# Altium schematic sheet Sheet1.SchDoc (part 2 of 3)
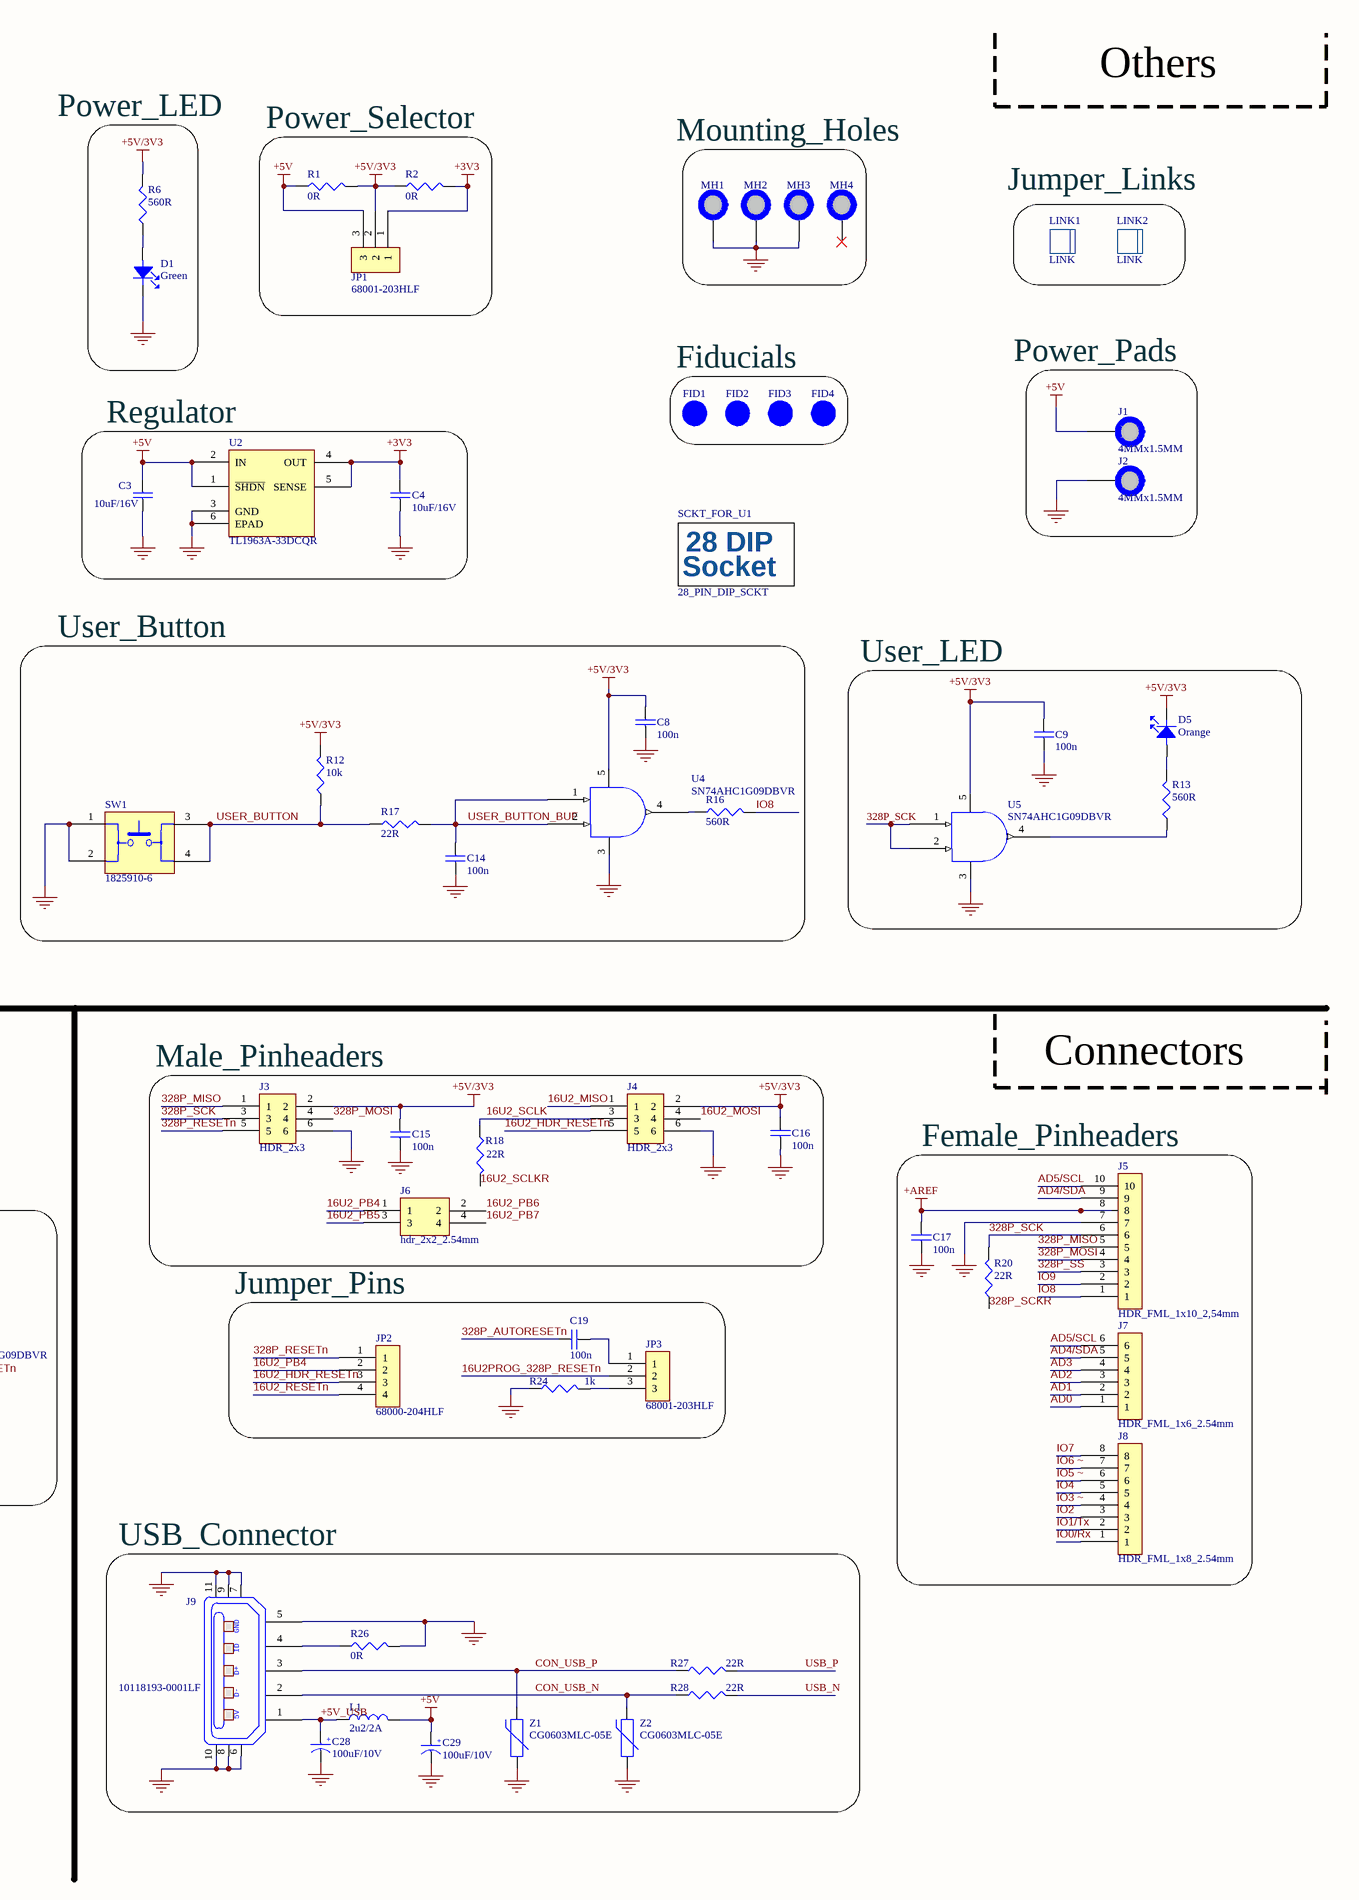
[diagram p2: Sheet1.SchDoc, right]
## Library data of the parts
C1 C8 C9 C18 C19 = capacitor_100n: Multilayer Ceramic Capacitor, 0.1 uF, 50 V, ± 10%, X7R, 0805 [2012 Metric]; Manufacturer: TDK; Manufacturer Part Number: C2012X7R1H104K085AA; Material: 4241ConductorMaterial; Capacitance: 100nF; Voltage Rating: 50V; Supplier 1: Arrow Electronics; RoHS: Yes; Category: Ceramic Capacitors; Stock 1: 84000; Pricing 1: 4000=0.0215, 8000=0.018, 12000=0.017, 28000=0.016, 100000=0.0129, 200000=0.0128, 400000=0.0125 (USD); Mount: Surface Mount; Case/Package: 0805; Number of Pins: 2; Case Code (Metric): 2012; Case Code (Imperial): 0805; Dielectric Material: Ceramic; Min Operating Temperature: -55°C; Max Operating Temperature: 125°C; Tolerance: 10%; Packaging: Tape and Reel; Dielectric: X7R; Package Quantity: 1; Termination: SMD/SMT; Voltage: 50V; Series: C; Length: 2mm; Width: 0.049inch; Height: 0.85mm; Depth: 1.25mm; Thickness: 0.037inch; RoHS Compliant: Yes; Reach SVHC Compliant: No; Lead Free: Lead Free; ComponentLink1URL: https://datasheet.ciiva.com/11788/0900766b80c1bb00-11788128.pdf?src-supplier=Rs; ComponentLink1Description: https://datasheet.ciiva.com/11788/0900766b80c1bb00-11788128.pdf?src-supplier=Rs; ComponentLink2URL: https://datasheet.ciiva.com/23803/1796654-23803035.pdf?src-supplier=Newark; ComponentLink2Description: https://datasheet.ciiva.com/23803/1796654-23803035.pdf?src-supplier=Newark; ComponentLink3URL: https://datasheet.ciiva.com/28602/1571323-28602204.pdf?src-supplier=Element14; ComponentLink3Description: https://datasheet.ciiva.com/28602/1571323-28602204.pdf?src-supplier=Element14; ComponentLink4URL: https://datasheet.ciiva.com/6250/tdkmlcccaprange-6250821.pdf?src-supplier=Digi-Key; ComponentLink4Description: https://datasheet.ciiva.com/6250/tdkmlcccaprange-6250821.pdf?src-supplier=Digi-Key; ComponentLink5URL: https://datasheet.ciiva.com/6250/tdkmlcccaprange-6250824.pdf?src-supplier=Digi-Key; ComponentLink5Description: https://datasheet.ciiva.com/6250/tdkmlcccaprange-6250824.pdf?src-supplier=Digi-Key; ComponentLink6URL: https://datasheet.ciiva.com/24191/e412-c-24191447.pdf?src-supplier=Future+Electronics; ComponentLink6Description: https://datasheet.ciiva.com/24191/e412-c-24191447.pdf?src-supplier=Future+Electronics; Supplier Part Number 1: C2012X7R1H104K085AA
C2 C6 C7 C12 C14-C17 C20 C21 C23 C27 C30 C31 C33 = C2012X7R1H104K085AA: Multilayer Ceramic Capacitor, 0.1 uF, 50 V, ± 10%, X7R, 0805 [2012 Metric]; Manufacturer: TDK; Material: 4241ConductorMaterial; Capacitance: 100nF; Voltage Rating: 50V; Supplier 1: Arrow Electronics; Manufacturer Part Number: C2012X7R1H104K085AA; RoHS: Yes; Category: Ceramic Capacitors; Stock 1: 84000; Pricing 1: 4000=0.0215, 8000=0.018, 12000=0.017, 28000=0.016, 100000=0.0129, 200000=0.0128, 400000=0.0125 (USD); Mount: Surface Mount; Case/Package: 0805; Number of Pins: 2; Case Code (Metric): 2012; Case Code (Imperial): 0805; Dielectric Material: Ceramic; Min Operating Temperature: -55°C; Max Operating Temperature: 125°C; Tolerance: 10%; Packaging: Tape and Reel; Dielectric: X7R; Package Quantity: 1; Termination: SMD/SMT; Voltage: 50V; Series: C; Length: 2mm; Width: 0.049inch; Height: 0.85mm; Depth: 1.25mm; Thickness: 0.037inch; RoHS Compliant: Yes; Reach SVHC Compliant: No; Lead Free: Lead Free; ComponentLink1URL: https://datasheet.ciiva.com/11788/0900766b80c1bb00-11788128.pdf?src-supplier=Rs; ComponentLink1Description: https://datasheet.ciiva.com/11788/0900766b80c1bb00-11788128.pdf?src-supplier=Rs; ComponentLink2URL: https://datasheet.ciiva.com/23803/1796654-23803035.pdf?src-supplier=Newark; ComponentLink2Description: https://datasheet.ciiva.com/23803/1796654-23803035.pdf?src-supplier=Newark; ComponentLink3URL: https://datasheet.ciiva.com/28602/1571323-28602204.pdf?src-supplier=Element14; ComponentLink3Description: https://datasheet.ciiva.com/28602/1571323-28602204.pdf?src-supplier=Element14; ComponentLink4URL: https://datasheet.ciiva.com/6250/tdkmlcccaprange-6250821.pdf?src-supplier=Digi-Key; ComponentLink4Description: https://datasheet.ciiva.com/6250/tdkmlcccaprange-6250821.pdf?src-supplier=Digi-Key; ComponentLink5URL: https://datasheet.ciiva.com/6250/tdkmlcccaprange-6250824.pdf?src-supplier=Digi-Key; ComponentLink5Description: https://datasheet.ciiva.com/6250/tdkmlcccaprange-6250824.pdf?src-supplier=Digi-Key; ComponentLink6URL: https://datasheet.ciiva.com/24191/e412-c-24191447.pdf?src-supplier=Future+Electronics; ComponentLink6Description: https://datasheet.ciiva.com/24191/e412-c-24191447.pdf?src-supplier=Future+Electronics; Supplier Part Number 1: C2012X7R1H104K085AA
C3 C4 = capacitor_10uF_16V: C Series 0805 10 uF 16 V ±10 % Tolerance X5R SMT Multilayer Ceramic Capacitor; Manufacturer: TDK; Manufacturer Part Number: C2012X5R1C106K085AC; Material: 4241ConductorMaterial; Supplier 1: Arrow Electronics; RoHS: Yes; Category: Ceramic Capacitors; Stock 1: 3158; Pricing 1: 1=0.2384, 10=0.1596, 25=0.1391, 50=0.1046, 100=0.0806, 250=0.0791, 500=0.0604, 1000=0.0477, 3000=0.0309 (USD); ComponentLink1URL: https://datasheet.ciiva.com/24218/c2012x5r1c106k085ac-264980-24218056.pdf?src-supplier=Mouser; ComponentLink1Description: https://datasheet.ciiva.com/24218/c2012x5r1c106k085ac-264980-24218056.pdf?src-supplier=Mouser; ComponentLink2URL: https://datasheet.ciiva.com/28451/1796654-28451610.pdf?src-supplier=Element14; ComponentLink2Description: https://datasheet.ciiva.com/28451/1796654-28451610.pdf?src-supplier=Element14; ComponentLink3URL: https://datasheet.ciiva.com/6259/tdkmlcccaprange-6259116.pdf?src-supplier=Digi-Key; ComponentLink3Description: https://datasheet.ciiva.com/6259/tdkmlcccaprange-6259116.pdf?src-supplier=Digi-Key; ComponentLink4URL: https://datasheet.ciiva.com/6259/tdkmlcccaprange-6259119.pdf?src-supplier=Digi-Key; ComponentLink4Description: https://datasheet.ciiva.com/6259/tdkmlcccaprange-6259119.pdf?src-supplier=Digi-Key; ComponentLink5URL: https://datasheet.ciiva.com/28602/1744655-28602170.pdf?src-supplier=Element14; ComponentLink5Description: https://datasheet.ciiva.com/28602/1744655-28602170.pdf?src-supplier=Element14; ComponentLink6URL: https://datasheet.ciiva.com/28673/mlcc-commercial-general-en-28673535.pdf?src-supplier=Element14; ComponentLink6Description: https://datasheet.ciiva.com/28673/mlcc-commercial-general-en-28673535.pdf?src-supplier=Element14; ComponentLink7URL: https://datasheet.ciiva.com/22719/1796654-22719549.pdf?src-supplier=Element14; ComponentLink7Description: https://datasheet.ciiva.com/22719/1796654-22719549.pdf?src-supplier=Element14; ComponentLink8URL: https://datasheet.ciiva.com/23803/1796654-23803020.pdf?src-supplier=Newark; ComponentLink8Description: https://datasheet.ciiva.com/23803/1796654-23803020.pdf?src-supplier=Newark; Supplier Part Number 1: C2012X5R1C106K085AC
C5 C24 C26 C32 = C2012X5R1C106K085AC: C Series 0805 10 uF 16 V ±10 % Tolerance X5R SMT Multilayer Ceramic Capacitor; Manufacturer: TDK; Material: 4241ConductorMaterial; Supplier 1: Arrow Electronics; Manufacturer Part Number: C2012X5R1C106K085AC; RoHS: Yes; Category: Ceramic Capacitors; Stock 1: 3158; Pricing 1: 1=0.2384, 10=0.1596, 25=0.1391, 50=0.1046, 100=0.0806, 250=0.0791, 500=0.0604, 1000=0.0477, 3000=0.0309 (USD); ComponentLink1URL: https://datasheet.ciiva.com/24218/c2012x5r1c106k085ac-264980-24218056.pdf?src-supplier=Mouser; ComponentLink1Description: https://datasheet.ciiva.com/24218/c2012x5r1c106k085ac-264980-24218056.pdf?src-supplier=Mouser; ComponentLink2URL: https://datasheet.ciiva.com/28451/1796654-28451610.pdf?src-supplier=Element14; ComponentLink2Description: https://datasheet.ciiva.com/28451/1796654-28451610.pdf?src-supplier=Element14; ComponentLink3URL: https://datasheet.ciiva.com/6259/tdkmlcccaprange-6259116.pdf?src-supplier=Digi-Key; ComponentLink3Description: https://datasheet.ciiva.com/6259/tdkmlcccaprange-6259116.pdf?src-supplier=Digi-Key; ComponentLink4URL: https://datasheet.ciiva.com/6259/tdkmlcccaprange-6259119.pdf?src-supplier=Digi-Key; ComponentLink4Description: https://datasheet.ciiva.com/6259/tdkmlcccaprange-6259119.pdf?src-supplier=Digi-Key; ComponentLink5URL: https://datasheet.ciiva.com/28602/1744655-28602170.pdf?src-supplier=Element14; ComponentLink5Description: https://datasheet.ciiva.com/28602/1744655-28602170.pdf?src-supplier=Element14; ComponentLink6URL: https://datasheet.ciiva.com/28673/mlcc-commercial-general-en-28673535.pdf?src-supplier=Element14; ComponentLink6Description: https://datasheet.ciiva.com/28673/mlcc-commercial-general-en-28673535.pdf?src-supplier=Element14; ComponentLink7URL: https://datasheet.ciiva.com/22719/1796654-22719549.pdf?src-supplier=Element14; ComponentLink7Description: https://datasheet.ciiva.com/22719/1796654-22719549.pdf?src-supplier=Element14; ComponentLink8URL: https://datasheet.ciiva.com/23803/1796654-23803020.pdf?src-supplier=Newark; ComponentLink8Description: https://datasheet.ciiva.com/23803/1796654-23803020.pdf?src-supplier=Newark; Supplier Part Number 1: C2012X5R1C106K085AC
C10 C13 C22 C25 = C0805C180K5GACTU: Multilayer Ceramic Capacitor, 18 pF, 50 V, ± 10%, C0G (NP0), 0805 [2012 Metric]; Manufacturer: KEMET; Material: 4241ConductorMaterial; Temperature Coefficient: 30ppm/°C; Supplier 1: Mouser; Manufacturer Part Number: C0805C180K5GACTU; RoHS: Yes; Category: Ceramic Capacitors; Stock 1: 30336; Pricing 1: 1=0.1, 10=0.04, 50=0.04, 100=0.023, 1000=0.018, 10000=0.013 (USD); Lead Free: 5697LeadFree; ComponentLink1URL: https://datasheet.ciiva.com/26847/getdatasheetpartid-742486-26847863.pdf?src-supplier=Verical; ComponentLink1Description: https://datasheet.ciiva.com/26847/getdatasheetpartid-742486-26847863.pdf?src-supplier=Verical; ComponentLink2URL: https://datasheet.ciiva.com/5412/kem-c1003-c0g-smd-356956-5412921.pdf?src-supplier=Mouser; ComponentLink2Description: https://datasheet.ciiva.com/5412/kem-c1003-c0g-smd-356956-5412921.pdf?src-supplier=Mouser; Supplier Part Number 1: 80-C0805C180K5G
C11 = capacitor_1uF: Multilayer Ceramic Capacitor, 1 uF, 25 V, ± 10%, X7R, 0805 [2012 Metric]; Manufacturer: TDK; Manufacturer Part Number: CGA4J3X7R1E105K125AB; Material: 4241ConductorMaterial; Supplier 1: Rs; RoHS: Yes; Category: Ceramic Capacitors; Stock 1: 500; Pricing 1: 100=0.034, 500=0.032, 1000=0.03, 2500=0.029, 5000=0.026 (GBP); ComponentLink1URL: https://datasheet.ciiva.com/24216/cga4j3x7r1e105k125ab-266263-24216931.pdf?src-supplier=Mouser; ComponentLink1Description: https://datasheet.ciiva.com/24216/cga4j3x7r1e105k125ab-266263-24216931.pdf?src-supplier=Mouser; Supplier Part Number 1: 9038723
C28 C29 = capacitor_100uF/10V: Cap Aluminum Polymer 100uF 10VDC 20% (5 X 6mm) SMD 0.035 Ohm 1800mA 2000h 105C Automotive T/R; Manufacturer: Nichicon; Manufacturer Part Number: PCG1A101MCL1GS; Supplier 1: Arrow Electronics; RoHS: Yes; Category: Polymer Capacitors; Stock 1: 240; Pricing 1: 1=0.897, 10=0.8036, 25=0.7518, 100=0.5555 (USD); ComponentLink1URL: https://datasheet.ciiva.com/102/e-cg-102197.pdf?src-supplier=Digi-Key; ComponentLink1Description: https://datasheet.ciiva.com/102/e-cg-102197.pdf?src-supplier=Digi-Key; ComponentLink2URL: https://datasheet.ciiva.com/102/e-cg-102198.pdf?src-supplier=Digi-Key; ComponentLink2Description: https://datasheet.ciiva.com/102/e-cg-102198.pdf?src-supplier=Digi-Key; ComponentLink3URL: https://datasheet.ciiva.com/102/e-cg-102199.pdf?src-supplier=Digi-Key; ComponentLink3Description: https://datasheet.ciiva.com/102/e-cg-102199.pdf?src-supplier=Digi-Key; Supplier Part Number 1: PCG1A101MCL1GS
D1 = green_led: Super Ultra Green 1.6 x 0.8 mm 120° Water Clear 50 mcd 2.2 V Surface Mount LED; Manufacturer: Lumex; Manufacturer Part Number: SML-LXFM0603SUGCTR; Supplier 1: Arrow Electronics; RoHS: Yes; Category: LEDs; Stock 1: 85; Pricing 1: 1=0.9815, 10=0.6442, 25=0.6365, 50=0.3819 (USD); ComponentLink1URL: https://datasheet.ciiva.com/16353/sml-lxfm0603sugctr-16353226.pdf?src-supplier=Future+Electronics; ComponentLink1Description: https://datasheet.ciiva.com/16353/sml-lxfm0603sugctr-16353226.pdf?src-supplier=Future+Electronics; ComponentLink2URL: https://datasheet.ciiva.com/4688/sml-lxfm0603sugctr-115255-4688799.pdf?src-supplier=Mouser; ComponentLink2Description: https://datasheet.ciiva.com/4688/sml-lxfm0603sugctr-115255-4688799.pdf?src-supplier=Mouser; Supplier Part Number 1: SML-LXFM0603SUGCTR
D2 D6 = BAT54HT1G: Small Signal Schottky Diode, Single, 30 V, 200 Ma, 800 Mv, 600 Ma, 150 C; Manufacturer: ON Semiconductor / Fairchild; Forward Current: 200mA; Max Reverse Current: 2uA; Recovery Time: 5ns; Max Repetitive Reverse Voltage (Vrrm): 30V; Peak Non-Repetitive Surge Current: 600mA; Forward Voltage: 800mV; Power Dissipation: 200mW; Polarity: Standard; Capacitance: 10pF; Supplier 1: Future Electronics; Manufacturer Part Number: BAT54HT1G; RoHS: Yes; Category: Schottky Diodes; Stock 1: 5595000; Pricing 1: 3000=0.0203, 12000=0.0195, 45000=0.0187, 75000=0.0184, 150000=0.0175 (USD); Mount: Surface Mount; Number of Pins: 2; Contact Plating: Tin,Matte; Min Operating Temperature: -55°C; Max Operating Temperature: 150°C; Packaging: Tape and Reel; Package Quantity: 1; Average Rectified Current: 200mA; Reverse Recovery Time: 5ns; Max Forward Surge Current (Ifsm): 600mA; Max Reverse Voltage (DC): 30V; Reverse Voltage: 30V; Series: -; Max Surge Current: 600mA; Voltage Rating (DC): 30V; Current Rating: 200mA; Output Current: 200mA; Max Reverse Leakage Current: 2uA; Reverse Recovery Time-Max: 5ns; Breakdown Voltage: 30V; Length: 1.8mm; Width: 1.35mm; Height: 1mm; Radiation Hardening: No; RoHS Compliant: Yes; Reach SVHC Compliant: No; Lead Free: Lead Free; ComponentLink1URL: https://datasheet.ciiva.com/4714/bat54ht1-d-72881-4714706.pdf?src-supplier=Mouser; ComponentLink1Description: https://datasheet.ciiva.com/4714/bat54ht1-d-72881-4714706.pdf?src-supplier=Mouser; ComponentLink2URL: https://datasheet.ciiva.com/4452/bat54ht1g-104602-4452889.pdf?src-supplier=Mouser; ComponentLink2Description: https://datasheet.ciiva.com/4452/bat54ht1g-104602-4452889.pdf?src-supplier=Mouser; ComponentLink3URL: https://datasheet.ciiva.com/30479/0900766b811a63a9-30479442.pdf?src-supplier=Rs; ComponentLink3Description: https://datasheet.ciiva.com/30479/0900766b811a63a9-30479442.pdf?src-supplier=Rs; ComponentLink4URL: https://datasheet.ciiva.com/34301/806549-34301562.pdf?src-supplier=Jameco; ComponentLink4Description: https://datasheet.ciiva.com/34301/806549-34301562.pdf?src-supplier=Jameco; ComponentLink5URL: https://datasheet.ciiva.com/1240/1747983-1240762.pdf?src-supplier=Newark; ComponentLink5Description: https://datasheet.ciiva.com/1240/1747983-1240762.pdf?src-supplier=Newark; ComponentLink6URL: https://datasheet.ciiva.com/915/bat54ht1-d-915445.pdf?src-supplier=Digi-Key; ComponentLink6Description: https://datasheet.ciiva.com/915/bat54ht1-d-915445.pdf?src-supplier=Digi-Key; ComponentLink7URL: https://datasheet.ciiva.com/915/bat54ht1-d-915444.pdf?src-supplier=Digi-Key; ComponentLink7Description: https://datasheet.ciiva.com/915/bat54ht1-d-915444.pdf?src-supplier=Digi-Key; ComponentLink8URL: https://datasheet.ciiva.com/910/bat54ht1g-910499.pdf?src-supplier=Digi-Key; ComponentLink8Description: https://datasheet.ciiva.com/910/bat54ht1g-910499.pdf?src-supplier=Digi-Key; ComponentLink9URL: https://datasheet.ciiva.com/910/bat54ht1g-910498.pdf?src-supplier=Digi-Key; ComponentLink9Description: https://datasheet.ciiva.com/910/bat54ht1g-910498.pdf?src-supplier=Digi-Key; ComponentLink10URL: https://datasheet.ciiva.com/8294/bat54ht1-d-8294645.pdf?src-supplier=Avnet; ComponentLink10Description: https://datasheet.ciiva.com/8294/bat54ht1-d-8294645.pdf?src-supplier=Avnet; ComponentLink11URL: https://datasheet.ciiva.com/910/bat54ht1g-910497.pdf?src-supplier=Digi-Key; ComponentLink11Description: https://datasheet.ciiva.com/910/bat54ht1g-910497.pdf?src-supplier=Digi-Key; ComponentLink12URL: https://datasheet.ciiva.com/8303/bat54ht1g-8303645.pdf?src-supplier=Avnet; ComponentLink12Description: https://datasheet.ciiva.com/8303/bat54ht1g-8303645.pdf?src-supplier=Avnet; ComponentLink13URL: https://datasheet.ciiva.com/915/bat54ht1-d-915443.pdf?src-supplier=Digi-Key; ComponentLink13Description: https://datasheet.ciiva.com/915/bat54ht1-d-915443.pdf?src-supplier=Digi-Key; ComponentLink14URL: https://datasheet.ciiva.com/46429/1727620-46429206.pdf?src-supplier=Element14; ComponentLink14Description: https://datasheet.ciiva.com/46429/1727620-46429206.pdf?src-supplier=Element14; ComponentLink15URL: https://datasheet.ciiva.com/1180/bat54ht1-d-1180252.pdf?src-supplier=Element14; ComponentLink15Description: https://datasheet.ciiva.com/1180/bat54ht1-d-1180252.pdf?src-supplier=Element14; ComponentLink16URL: https://datasheet.ciiva.com/1180/bat54ht1-d-1180251.pdf?src-supplier=Element14; ComponentLink16Description: https://datasheet.ciiva.com/1180/bat54ht1-d-1180251.pdf?src-supplier=Element14; ComponentLink17URL: https://datasheet.ciiva.com/17020/bat54ht1g-17020445.pdf?src-supplier=Future+Electronics; ComponentLink17Description: https://datasheet.ciiva.com/17020/bat54ht1g-17020445.pdf?src-supplier=Future+Electronics; ComponentLink18URL: https://datasheet.ciiva.com/48686/001262925-da-01-en-diode-schottky-30v-bat54ht1g-sod-323-fsc-48686266.pdf?src-supplier=Conrad; ComponentLink18Description: https://datasheet.ciiva.com/48686/001262925-da-01-en-diode-schottky-30v-bat54ht1g-sod-323-fsc-48686266.pdf?src-supplier=Conrad; Supplier Part Number 1: 1155100
D3-D5 = orange_led: LED Low-Power Uni-Color SB. Orange 611nm 1.8V 2-Pin SMD T/R; Manufacturer: Kingbright; Manufacturer Part Number: APT1608LSECK/J4-PRV; Supplier 1: Digi-Key; RoHS: Yes; Category: LEDs; Stock 1: 48397; Pricing 1: 1=0.64, 10=0.396, 100=0.2277, 1000=0.17816 (USD); ComponentLink1URL: http://www.mouser.com/ds/2/216/APT1608LSECK-J4-PRV-535751.pdf?src-supplier=Mouser; ComponentLink1Description: http://www.mouser.com/ds/2/216/APT1608LSECK-J4-PRV-535751.pdf?src-supplier=Mouser; ComponentLink2URL: http://www.kingbrightusa.com/images/catalog/SPEC/APT1608LSECK-J4-PRV.pdf?src-supplier=Digi-Key; ComponentLink2Description: http://www.kingbrightusa.com/images/catalog/SPEC/APT1608LSECK-J4-PRV.pdf?src-supplier=Digi-Key
FB1-FB3 = MPZ2012S601AT000: Ferrite Beads Multi-Layer Power 600Ohm 25% 100MHz 2A 100mOhm DCR 0805 T/R; Manufacturer: TDK; Impedance: 600R; DC Resistance (DCR): 100mR; Number of Lines: 1; Supplier 1: Arrow Electronics; Manufacturer Part Number: MPZ2012S601AT000; RoHS: Yes; Category: Ferrite Beads and Chips; Stock 1: 8000; Pricing 1: 4000=0.027, 8000=0.023, 28000=0.0228, 100000=0.0225 (USD); Mount: Surface Mount; Case/Package: 0805; Case Code (Metric): 2012; Case Code (Imperial): 0805; Core Material: Ferrite; Min Operating Temperature: -55°C; Max Operating Temperature: 125°C; Packaging: Tape and Reel; Package Quantity: 1; Current Rating: 2A; Max DC Current: 2A; Series: MPZ; Test Frequency: 100MHz; Tolerance: 25%; Max Current Rating: 2A; RMS Current (Irms): 2A; Series Resistance: 100mR; Length: 0.079inch; Width: 0.049inch; Height: 0.041inch; Reach SVHC Compliant: No; Lead Free: Lead Free; RoHS Compliant: Yes; ComponentLink1URL: https://datasheet.ciiva.com/46634/beads-commercial-power-mpz-en-46634335.pdf?src-supplier=Digi-Key; ComponentLink1Description: https://datasheet.ciiva.com/46634/beads-commercial-power-mpz-en-46634335.pdf?src-supplier=Digi-Key; ComponentLink2URL: https://datasheet.ciiva.com/46634/beads-commercial-power-mpz-en-46634377.pdf?src-supplier=Digi-Key; ComponentLink2Description: https://datasheet.ciiva.com/46634/beads-commercial-power-mpz-en-46634377.pdf?src-supplier=Digi-Key; ComponentLink3URL: https://datasheet.ciiva.com/46634/beads-commercial-power-mpz-en-46634606.pdf?src-supplier=Digi-Key; ComponentLink3Description: https://datasheet.ciiva.com/46634/beads-commercial-power-mpz-en-46634606.pdf?src-supplier=Digi-Key; Supplier Part Number 1: MPZ2012S601AT000
FID1-FID4 = FID_1MM: Fiducial 40mil Diameter, 120mil mask.
J1 J2 = PAD_WITH_HOLE_4MMx1.5MM: Pad with a whole 4mm x 1.5mm
J3 J4 = 67997-206HLF: Conn Unshrouded Header HDR 6 POS 2.54mm Solder ST Top Entry Thru-Hole BergStik® Bulk; Manufacturer: Amphenol ICC / FCI; Supplier 1: Arrow Electronics; Manufacturer Part Number: 67997-206HLF; RoHS: No; Category: Headers and Wire Housings; Stock 1: 1251; Pricing 1: 1=0.4055, 10=0.3348, 25=0.3314, 50=0.3281, 100=0.2392, 1000=0.2033 (USD); ComponentLink1URL: http://uk.rs-online.com/webdocs/1450/0900766b81450b9f.pdf?src-supplier=Rs; ComponentLink1Description: http://uk.rs-online.com/webdocs/1450/0900766b81450b9f.pdf?src-supplier=Rs; ComponentLink2URL: https://datasheet.octopart.com/67997-206HLF-Amphenol-Communications-Solutions-datasheet-10288749.pdf?src-supplier=Newark; ComponentLink2Description: https://datasheet.octopart.com/67997-206HLF-Amphenol-Communications-Solutions-datasheet-10288749.pdf?src-supplier=Newark; ComponentLink3URL: https://datasheet.octopart.com/67997-206HLF-Areva-datasheet-15888151.pdf?src-supplier=Element14; ComponentLink3Description: https://datasheet.octopart.com/67997-206HLF-Areva-datasheet-15888151.pdf?src-supplier=Element14; ComponentLink4URL: https://www.alliedelec.com/m/d/513ec3cc6ba1d1ea2d72c003449a9fb2.pdf?src-supplier=Allied+Electronics; ComponentLink4Description: https://www.alliedelec.com/m/d/513ec3cc6ba1d1ea2d72c003449a9fb2.pdf?src-supplier=Allied+Electronics; ComponentLink5URL: http://components.arrow.com/part/dataview/41913726S7403011N8314?src-supplier=Arrow+Electronics; ComponentLink5Description: http://components.arrow.com/part/dataview/41913726S7403011N8314?src-supplier=Arrow+Electronics; ComponentLink6URL: http://portal.fciconnect.com/Comergent/adirect/fci?cmd=catCustomerDrawing&productName=67997-206HLF&src-supplier=Mouser; ComponentLink6Description: http://portal.fciconnect.com/Comergent/adirect/fci?cmd=catCustomerDrawing&productName=67997-206HLF&src-supplier=Mouser; ComponentLink7URL: http://portal.fciconnect.com/Comergent/fci/drawing/67996.pdf?src-supplier=Avnet; ComponentLink7Description: http://portal.fciconnect.com/Comergent/fci/drawing/67996.pdf?src-supplier=Avnet; ComponentLink8URL: https://cdn.amphenol-icc.com/media/wysiwyg/files/drawing/67996.pdf?src-supplier=Digi-Key; ComponentLink8Description: https://cdn.amphenol-icc.com/media/wysiwyg/files/drawing/67996.pdf?src-supplier=Digi-Key; ComponentLink9URL: https://datasheet.octopart.com/67997-206HLF-Amphenol-Communications-Solutions-datasheet-36854132.pdf?src-supplier=Electro+Sonic; ComponentLink9Description: https://datasheet.octopart.com/67997-206HLF-Amphenol-Communications-Solutions-datasheet-36854132.pdf?src-supplier=Electro+Sonic; Supplier Part Number 1: 67997-206HLF
J5 = M20-7821046: 2.54mm (0.1") Pitch SIL Vertical PC Tail Socket Assembly, tin, 10 contacts; Manufacturer: Harwin; Supplier 1: Rs; Manufacturer Part Number: M20-7821046; RoHS: Yes; Category: Headers and Wire Housings; Stock 1: 515; Pricing 1: 5=1.166, 100=0.892, 375=0.804, 1500=0.652, 3000=0.59 (GBP); ComponentLink1URL: https://datasheet.ciiva.com/11753/0900766b80dc1d2b-11753869.pdf?src-supplier=Rs; ComponentLink1Description: https://datasheet.ciiva.com/11753/0900766b80dc1d2b-11753869.pdf?src-supplier=Rs; ComponentLink2URL: https://datasheet.ciiva.com/26899/getdatasheetpartid-559226-26899379.pdf?src-supplier=Verical; ComponentLink2Description: https://datasheet.ciiva.com/26899/getdatasheetpartid-559226-26899379.pdf?src-supplier=Verical; ComponentLink3URL: https://datasheet.ciiva.com/10151/m20-782-10151366.pdf?src-supplier=Avnet; ComponentLink3Description: https://datasheet.ciiva.com/10151/m20-782-10151366.pdf?src-supplier=Avnet; ComponentLink4URL: https://datasheet.ciiva.com/6785/m20-782-6785605.pdf?src-supplier=Digi-Key; ComponentLink4Description: https://datasheet.ciiva.com/6785/m20-782-6785605.pdf?src-supplier=Digi-Key; Supplier Part Number 1: 6816826
J6 = 77313-118-04LF: BergStik®, Board to Board connector, Unshrouded Header, 2.54 mm Pitch, Vertical, Double Row, Through Hole, 04 Positions; Manufacturer: Amphenol ICC / FCI; Number of Positions: 4; Pitch: 0.1inch; Supplier 1: Arrow Electronics; Manufacturer Part Number: 77313-118-04LF; RoHS: No; Category: Connectors; Stock 1: 1364; Pricing 1: 1=0.1428, 10=0.1135 (USD); Mount: Through Hole; Contact Plating: Gold,GXT; Color: Black; Contact Material: Bronze; Series: BERGSTIK®, MezzSelect™, Basics+; Packaging: Bulk; Contact Type: Male Pin; Number of Rows: 2; Termination: Solder; Number of Contacts: 4; Row Spacing: 0.1inch; Contact Mating Length: 0.23inch; Reach SVHC Compliant: No; ComponentLink1URL: https://datasheet.ciiva.com/722/77313-722655.pdf?src-supplier=Digi-Key; ComponentLink1Description: https://datasheet.ciiva.com/722/77313-722655.pdf?src-supplier=Digi-Key; Supplier Part Number 1: 77313-118-04LF
J7 = M20-7820646: 2.54mm (0.1") Pitch SIL Vertical PC Tail Socket Assembly, tin, 6 contacts; Manufacturer: Harwin; Connector Type: Receptacle; Number of Positions: 6; Gender: Female; Voltage Rating: 1kV; Mated Stacking Heights: 12.63mm; Supplier 1: Rs; Manufacturer Part Number: M20-7820646; RoHS: Yes; Category: Headers and Wire Housings; Stock 1: 684; Pricing 1: 36=0.809, 180=0.755, 360=0.674, 720=0.608 (GBP); Mount: Through Hole; Case/Package: SIL; Contact Plating: Tin; Contact Material: Bronze; Contact Finish - Mating: TIN; Insulation Color: Black; Insulation Material: Nylon; Contact Shape: Square; Min Operating Temperature: -40°C; Max Operating Temperature: 105°C; Packaging: Rail/Tube; Number of Rows: 1; Contact Gender: Female; Package Quantity: 38; Termination: Solder; Number of Contacts: 6; Series: M20; Contact Type: Female Socket; Fastening Type: Pull; Pitch: 2.54mm; Radiation Hardening: No; RoHS Compliant: Yes; Flammability Rating: UL94 V-0; ComponentLink1URL: https://cdn.harwin.com/pdfs/Harwin_PC_Connectors_M20.pdf?src-supplier=Rs; ComponentLink1Description: https://cdn.harwin.com/pdfs/Harwin_PC_Connectors_M20.pdf?src-supplier=Rs; ComponentLink2URL: http://www.harwin.com/include/downloads/pdfs/2010PAGE120.PDF?src-supplier=Avnet; ComponentLink2Description: http://www.harwin.com/include/downloads/pdfs/2010PAGE120.PDF?src-supplier=Avnet; ComponentLink3URL: https://cdn.harwin.com/pdfs/M20-782.pdf?src-supplier=Digi-Key; ComponentLink3Description: https://cdn.harwin.com/pdfs/M20-782.pdf?src-supplier=Digi-Key; ComponentLink4URL: https://cdn.harwin.com/pdfs/Harwin_PC_Connectors_M20.pdf?src-supplier=Mouser; ComponentLink4Description: https://cdn.harwin.com/pdfs/Harwin_PC_Connectors_M20.pdf?src-supplier=Mouser; ComponentLink5URL: https://cdn.harwin.com/pdfs/Harwin_PC_Connectors_M20.pdf?src-supplier=TTI; ComponentLink5Description: https://cdn.harwin.com/pdfs/Harwin_PC_Connectors_M20.pdf?src-supplier=TTI; Supplier Part Number 1: 1613515
J8 J10 = M20-7820842: 2.54mm (0.1") Pitch SIL Vertical PC Tail Socket Assembly, selective gold + tin, 8 contacts; Manufacturer: Harwin; Number of Positions: 8; Connector Type: Receptacle; Gender: Female; Voltage Rating: 1kV; Mated Stacking Heights: 12.63mm; Supplier 1: Digi-Key; Manufacturer Part Number: M20-7820842; RoHS: Yes; Category: Headers and Wire Housings; Stock 1: 4089; Pricing 1: 1=1.44, 10=1.215, 100=1.091, 500=0.89264, 1000=0.79346, 5000=0.69427, 10000=0.65956 (USD); Mount: Through Hole; Case/Package: SIL; Contact Plating: Tin,Gold; Contact Material: Bronze; Weight: 0.025397oz; Contact Finish - Mating: GOLD; Insulation Color: Black; Insulation Material: Nylon; Contact Shape: Square; Min Operating Temperature: -40°C; Max Operating Temperature: 105°C; Number of Rows: 1; Contact Gender: Female; Packaging: Rail/Tube; Termination: Solder; Number of Contacts: 8; Series: M20; Contact Type: Female Socket; Fastening Type: Pull; Pitch: 2.54mm; Radiation Hardening: No; RoHS Compliant: Yes; Flammability Rating: UL94 V-0; ComponentLink1URL: https://datasheet.ciiva.com/9480/m20-782-9480074.pdf?src-supplier=Avnet; ComponentLink1Description: https://datasheet.ciiva.com/9480/m20-782-9480074.pdf?src-supplier=Avnet; Supplier Part Number 1: 952-1823-ND
J9 = 10118193-0001LF: Usb Connector, 5 Contact(S), Female, Right Angle, Surface Mount Terminal, Locking, Receptacle; Manufacturer: Amphenol Communications Solutions; Gender: 30Gender; Insulation Resistance: 1GR; Number of Contacts: 5NUMBER; Number of Ports: 1NUMBER; Connector Type: 309,4640ConnectorType; USB Standard: 6108USBStandard; Max Voltage Rating (AC): 100V; Current Rating: 1.8A; Pitch: 650um; Supplier 1: Arrow Electronics; Manufacturer Part Number: 10118193-0001LF; RoHS: No; Category: Connectors; Stock 1: 76800; Pricing 1: 9600=0.1971 (USD); Mount: 8,4608Mount; Number of Pins: 11NUMBER; Housing Material: 4242ConductorMaterial; Color: 46Colour; Contact Material: 153,157ConductorMaterial; Contact Plating: 157ConductorMaterial; Min Operating Temperature: -55°C; Max Operating Temperature: 85°C; Orientation: 5492OrientationType; Termination: 4558ConnectorType; Voltage Rating: 100V; Features: 6303FeaturesType; Length: 7.86mm; Height: 3mm; Depth: 5.67mm; Radiation Hardening: 5898YesNo; Flammability Rating: 5813Flammability; ComponentLink1URL: https://datasheet.octopart.com/10118193-0001LF-Amphenol-Communications-Solutions-datasheet-96019471.pdf?src-supplier=Element14; ComponentLink1Description: https://datasheet.octopart.com/10118193-0001LF-Amphenol-Communications-Solutions-datasheet-96019471.pdf?src-supplier=Element14; ComponentLink2URL: https://datasheet.octopart.com/10118193-0001LF-Amphenol-Communications-Solutions-datasheet-55953155.pdf?src-supplier=TME; ComponentLink2Description: https://datasheet.octopart.com/10118193-0001LF-Amphenol-Communications-Solutions-datasheet-55953155.pdf?src-supplier=TME; ComponentLink3URL: https://datasheet.octopart.com/10118193-0001LF-Amphenol-Communications-Solutions-datasheet-11792339.pdf?src-supplier=Electro+Sonic; ComponentLink3Description: https://datasheet.octopart.com/10118193-0001LF-Amphenol-Communications-Solutions-datasheet-11792339.pdf?src-supplier=Electro+Sonic; Supplier Part Number 1: 10118193-0001LF
JP1 JP3 = HDR_1x3_2.54mm: Conn Unshrouded Header HDR 3 POS 2.54mm Solder ST Top Entry Thru-Hole BergStik® Bulk; Manufacturer: Amphenol ICC / FCI; Supplier 1: Arrow Electronics; Manufacturer Part Number: 68001-203HLF; RoHS: No; Category: Headers and Wire Housings; Stock 1: 2787; Pricing 1: 1=0.2219, 10=0.1626, 25=0.1592, 50=0.1576, 100=0.102, 1000=0.084 (USD); ComponentLink1URL: http://uk.rs-online.com/webdocs/1450/0900766b81450c64.pdf?src-supplier=Rs; ComponentLink1Description: http://uk.rs-online.com/webdocs/1450/0900766b81450c64.pdf?src-supplier=Rs; ComponentLink2URL: https://www.alliedelec.com/m/d/5c9a93367e9d0f191689c8d93ba26bad.pdf?src-supplier=Allied+Electronics; ComponentLink2Description: https://www.alliedelec.com/m/d/5c9a93367e9d0f191689c8d93ba26bad.pdf?src-supplier=Allied+Electronics; ComponentLink3URL: https://datasheet.octopart.com/68001-203HLF-Areva-datasheet-10088795.pdf?src-supplier=Newark; ComponentLink3Description: https://datasheet.octopart.com/68001-203HLF-Areva-datasheet-10088795.pdf?src-supplier=Newark; ComponentLink4URL: https://cdn.amphenol-icc.com/media/wysiwyg/files/drawing/68000.pdf?src-supplier=Digi-Key; ComponentLink4Description: https://cdn.amphenol-icc.com/media/wysiwyg/files/drawing/68000.pdf?src-supplier=Digi-Key; ComponentLink5URL: http://www.mouser.com/ds/2/154/68000-274373.pdf?src-supplier=Mouser; ComponentLink5Description: http://www.mouser.com/ds/2/154/68000-274373.pdf?src-supplier=Mouser; ComponentLink6URL: http://components.arrow.com/part/dataview/41914271S7424575N8314?src-supplier=Arrow+Electronics; ComponentLink6Description: http://components.arrow.com/part/dataview/41914271S7424575N8314?src-supplier=Arrow+Electronics; ComponentLink7URL: http://portal.fciconnect.com/Comergent/fci/drawing/68000.pdf?src-supplier=Avnet; ComponentLink7Description: http://portal.fciconnect.com/Comergent/fci/drawing/68000.pdf?src-supplier=Avnet; ComponentLink8URL: https://datasheet.octopart.com/68001-203HLF-FCI-datasheet-41232361.pdf?src-supplier=Farnell; ComponentLink8Description: https://datasheet.octopart.com/68001-203HLF-FCI-datasheet-41232361.pdf?src-supplier=Farnell; ComponentLink9URL: http://www.farnell.com/datasheets/1914865.pdf?src-supplier=Element14; ComponentLink9Description: http://www.farnell.com/datasheets/1914865.pdf?src-supplier=Element14; ComponentLink10URL: http://www.farnell.com/datasheets/1914865.pdf?src-supplier=Newark; ComponentLink10Description: http://www.farnell.com/datasheets/1914865.pdf?src-supplier=Newark; Supplier Part Number 1: 68001-203HLF
JP2 = HDR_1x4_2.54mm: Conn Unshrouded Header HDR 4 POS 2.54mm Solder ST Top Entry Thru-Hole BergStik® Bulk; Manufacturer: Amphenol ICC / FCI; Supplier 1: Arrow Electronics; Manufacturer Part Number: 68000-204HLF; RoHS: No; Category: Headers and Wire Housings; Stock 1: 50; Pricing 1: 1=0.3141, 10=0.2614, 25=0.2588, 50=0.2562, 100=0.2072, 1000=0.1426 (USD); ComponentLink1URL: https://datasheet.ciiva.com/46395/1914865-46395853.pdf?src-supplier=Element14; ComponentLink1Description: https://datasheet.ciiva.com/46395/1914865-46395853.pdf?src-supplier=Element14; Supplier Part Number 1: 68000-204HLF
L1 = inductor_2.2uH: General Purpose Inductor, 2.2uH, 20%, 1 Element, Ferrite-Core, SMD, 1210; Manufacturer: KEMET; Manufacturer Part Number: L1210R2R2MDWIT; Supplier 1: Mouser; RoHS: Yes; Category: Fixed Inductors; Stock 1: 5971; Pricing 1: 1=0.42, 10=0.301, 50=0.301, 100=0.217, 1000=0.189, 10000=0.174 (USD); ComponentLink1URL: https://datasheet.ciiva.com/6691/f3115-6691487.pdf?src-supplier=Digi-Key; ComponentLink1Description: https://datasheet.ciiva.com/6691/f3115-6691487.pdf?src-supplier=Digi-Key; ComponentLink2URL: https://datasheet.ciiva.com/4957/f3115-4957838.pdf?src-supplier=Mouser; ComponentLink2Description: https://datasheet.ciiva.com/4957/f3115-4957838.pdf?src-supplier=Mouser; ComponentLink3URL: https://datasheet.ciiva.com/22685/27262-22685038.pdf?src-supplier=Element14; ComponentLink3Description: https://datasheet.ciiva.com/22685/27262-22685038.pdf?src-supplier=Element14; ComponentLink4URL: https://datasheet.ciiva.com/8512/f3115-8512543.pdf?src-supplier=Avnet; ComponentLink4Description: https://datasheet.ciiva.com/8512/f3115-8512543.pdf?src-supplier=Avnet
LINK1 LINK2 = link: 2 Position 2.54 mm Centerline Single Circuit Open Top Jumper; Manufacturer: Sullins; Manufacturer Part Number: QPC02SXGN-RC; Supplier 1: Digi-Key; RoHS: Yes; Category: Connectors; Stock 1: 427917; Pricing 1: 1=0.1, 10=0.05, 25=0.0416, 50=0.0382, 100=0.0369, 250=0.03184, 500=0.03058, 1000=0.02675, 2500=0.02421 (USD); ComponentLink1URL: https://datasheet.ciiva.com/767/284-sxgn-11510-767869.pdf?src-supplier=Digi-Key; ComponentLink1Description: https://datasheet.ciiva.com/767/284-sxgn-11510-767869.pdf?src-supplier=Digi-Key; Supplier Part Number 1: S9337-ND
MH1-MH3 = MH_7.4MMC_3.2MMD: Mounting hole 7.4mm diameter 3.2mm drill.
MH4 = MH_7.4MMNC_3.2MMD: Mounted hole 7.4mm diamater non copper 3.2mm drill
R1 R2 R9 R26 = CR0805AJ/-000EAS: Zero Ohm Resistor, Jumper, 0805 [2012 Metric], Thick Film, 125 mW, 2 A, Surface Mount; Manufacturer: Bourns; Power Rating: 125mW; Tolerance: 5%; Voltage Rating: 150V; Supplier 1: Avnet; Manufacturer Part Number: CR0805AJ/-000EAS; RoHS: Yes; Category: Chip SMD Resistors; Stock 1: 1009; Pricing 1: 1=0.102, 25=0.021, 50=0.017, 100=0.012 (USD); Case/Package: 339Case; Min Operating Temperature: -55°C; Max Operating Temperature: 155°C; Resistance: 0R; Voltage Rating (DC): 150V; Height: 600um; ComponentLink1URL: https://www.bourns.com/docs/product-datasheets/crxxxxa-as.pdf?src-supplier=Digi-Key; ComponentLink1Description: https://www.bourns.com/docs/product-datasheets/crxxxxa-as.pdf?src-supplier=Digi-Key; ComponentLink2URL: https://datasheet.octopart.com/CR0805AJ--000EAS-Bourns-datasheet-166097895.pdf?src-supplier=Electro+Sonic; ComponentLink2Description: https://datasheet.octopart.com/CR0805AJ--000EAS-Bourns-datasheet-166097895.pdf?src-supplier=Electro+Sonic
R3 R4 R6 R13 R16 = RC0805FR-10560RL: Res Thick Film 0805 560 Ohm 1% 1/8W ±100ppm/°C Molded SMD SMD Paper T/R; Manufacturer: Yageo; Supplier 1: Digi-Key; Manufacturer Part Number: RC0805FR-10560RL; RoHS: Yes; Category: Chip SMD Resistors; Stock 1: 25803; Pricing 1: 1=0.1, 10=0.025, 50=0.016, 100=0.0133, 500=0.00912, 1000=0.00787, 5000=0.00577 (USD); Case/Package: 0805; Contact Plating: Tin,Matte; Min Operating Temperature: -55°C; Max Operating Temperature: 155°C; Resistance: 560R; Tolerance: 1%; Temperature Coefficient: 100ppm/°C; RoHS Compliant: Yes; ComponentLink1URL: http://www.yageo.com/documents/recent/PYu-RC_Group_51_RoHS_L_2.pdf?src-supplier=Avnet; ComponentLink1Description: http://www.yageo.com/documents/recent/PYu-RC_Group_51_RoHS_L_2.pdf?src-supplier=Avnet
R5 R8 R12 R19 R21 R22 = RC0805FR-0710KL: SMD Chip Resistor, 10 kOhm, ± 1%, 125 mW, 0805 [2012 Metric], Thick Film, General Purpose; Manufacturer: Yageo; Resistance: 10kR; Temperature Coefficient: 100ppm/°C; Power Rating: 125mW; Voltage Rating: 150V; Supplier 1: Future Electronics; Manufacturer Part Number: RC0805FR-0710KL; RoHS: Yes; Category: Chip SMD Resistors; Stock 1: 20315000; Pricing 1: 5000=0.0025, 25000=0.0023, 100000=0.0022, 250000=0.0021, 625000=0.002 (USD); Case/Package: 0805; Case Code (Imperial): 0805; Case Code (Metric): 2012; Size Code: 0805; Min Operating Temperature: -55°C; Max Operating Temperature: 155°C; Packaging: Tape and Reel; Tolerance: 1%; Resistor Type: Thick Film; Package Quantity: 1; Termination: SMD/SMT; Number of Terminations: 2; Max Power Dissipation: 125mW; Features: Moisture Resistant; Series: RC; Construction: Rectangular; Resistance Tolerance: 1%; Technology: THICK FILM; Voltage Rating (AC): 150V; Length: 0.079inch; Width: 0.049inch; Height: 0.024inch; Depth: 1.25mm; Lead Free: Lead Free; Reach SVHC Compliant: Unknown; Military Standard: Not; RoHS Compliant: Yes
R7 R17 R18 R20 R23 R27 R28 = RC0805FR-0722RL: SMD Chip Resistor, 22 Ohm, ± 1%, 125 mW, 0805 [2012 Metric], Thick Film, General Purpose; Manufacturer: Yageo; Voltage Rating (AC): 150V; Supplier 1: Future Electronics; Manufacturer Part Number: RC0805FR-0722RL; RoHS: Yes; Category: Chip SMD Resistors; Stock 1: 2795000; Pricing 1: 5000=0.0025, 25000=0.0023, 100000=0.0022, 250000=0.0021, 625000=0.002 (USD); ComponentLink1URL: https://datasheet.ciiva.com/11819/0900766b8106beab-11819837.pdf?src-supplier=Rs; ComponentLink1Description: https://datasheet.ciiva.com/11819/0900766b8106beab-11819837.pdf?src-supplier=Rs; ComponentLink2URL: https://datasheet.ciiva.com/2457/pyu-r-int-thick-7-2457045.pdf?src-supplier=Digi-Key; ComponentLink2Description: https://datasheet.ciiva.com/2457/pyu-r-int-thick-7-2457045.pdf?src-supplier=Digi-Key; ComponentLink3URL: https://datasheet.ciiva.com/2457/pyu-r-int-thick-7-2457046.pdf?src-supplier=Digi-Key; ComponentLink3Description: https://datasheet.ciiva.com/2457/pyu-r-int-thick-7-2457046.pdf?src-supplier=Digi-Key; ComponentLink4URL: https://datasheet.ciiva.com/12667/rc0805-12667371.pdf?src-supplier=Mouser; ComponentLink4Description: https://datasheet.ciiva.com/12667/rc0805-12667371.pdf?src-supplier=Mouser; ComponentLink5URL: https://datasheet.ciiva.com/2457/pyu-r-int-thick-7-2457044.pdf?src-supplier=Digi-Key; ComponentLink5Description: https://datasheet.ciiva.com/2457/pyu-r-int-thick-7-2457044.pdf?src-supplier=Digi-Key; ComponentLink6URL: https://datasheet.ciiva.com/46447/444164-46447574.pdf?src-supplier=Element14; ComponentLink6Description: https://datasheet.ciiva.com/46447/444164-46447574.pdf?src-supplier=Element14; Supplier Part Number 1: 3012390
R10 = RC0805FR-07100KL: SMD Chip Resistor, 100 kOhm, ± 1%, 125 mW, 0805 [2012 Metric], Thick Film, General Purpose; Manufacturer: Yageo; Resistance: 100kR; Power Rating: 125mW; Voltage Rating (DC): 150V; Temperature Coefficient: 100ppm/°C; Supplier 1: Future Electronics; Manufacturer Part Number: RC0805FR-07100KL; RoHS: Yes; Category: Chip SMD Resistors; Stock 1: 3045000; Pricing 1: 5000=0.0025, 25000=0.0023, 100000=0.0022, 250000=0.0021, 625000=0.002 (USD); Case/Package: 0805; Number of Pins: 2; Case Code (Metric): 2012; Case Code (Imperial): 0805; Size Code: 0805; Min Operating Temperature: -55°C; Max Operating Temperature: 155°C; Resistor Type: Thick Film; Tolerance: 1%; Packaging: Tape and Reel; Voltage Rating: 150V; Package Quantity: 1; Number of Terminations: 2; Termination: SMD/SMT; Max Power Dissipation: 125mW; Features: Moisture Resistant; Series: RC; Construction: Rectangular; Resistance Tolerance: 1%; Technology: THICK FILM; Voltage Rating (AC): 150V; Length: 0.079inch; Width: 0.049inch; Height: 0.024inch; Depth: 1.25mm; Lead Pitch: 0.4mm; RoHS Compliant: Yes; Reach SVHC Compliant: Unknown; Lead Free: 5697LeadFree; Military Standard: Not; ComponentLink1URL: https://datasheet.ciiva.com/11808/0900766b8106beab-11808858.pdf?src-supplier=Rs; ComponentLink1Description: https://datasheet.ciiva.com/11808/0900766b8106beab-11808858.pdf?src-supplier=Rs; ComponentLink2URL: https://datasheet.ciiva.com/7941/1686128-7941677.pdf?src-supplier=Element14; ComponentLink2Description: https://datasheet.ciiva.com/7941/1686128-7941677.pdf?src-supplier=Element14; ComponentLink3URL: https://datasheet.ciiva.com/7660/38627-7660796.pdf?src-supplier=Element14; ComponentLink3Description: https://datasheet.ciiva.com/7660/38627-7660796.pdf?src-supplier=Element14; ComponentLink4URL: https://datasheet.ciiva.com/22747/444164-22747534.pdf?src-supplier=Element14; ComponentLink4Description: https://datasheet.ciiva.com/22747/444164-22747534.pdf?src-supplier=Element14; ComponentLink5URL: https://datasheet.ciiva.com/2457/pyu-r-int-thick-7-2457018.pdf?src-supplier=Digi-Key; ComponentLink5Description: https://datasheet.ciiva.com/2457/pyu-r-int-thick-7-2457018.pdf?src-supplier=Digi-Key; ComponentLink6URL: https://datasheet.ciiva.com/2457/pyu-r-int-thick-7-2457019.pdf?src-supplier=Digi-Key; ComponentLink6Description: https://datasheet.ciiva.com/2457/pyu-r-int-thick-7-2457019.pdf?src-supplier=Digi-Key; ComponentLink7URL: https://datasheet.ciiva.com/2457/pyu-r-int-thick-7-2457017.pdf?src-supplier=Digi-Key; ComponentLink7Description: https://datasheet.ciiva.com/2457/pyu-r-int-thick-7-2457017.pdf?src-supplier=Digi-Key; ComponentLink8URL: https://datasheet.ciiva.com/12667/rc0805-12667001.pdf?src-supplier=Mouser; ComponentLink8Description: https://datasheet.ciiva.com/12667/rc0805-12667001.pdf?src-supplier=Mouser; ComponentLink9URL: https://datasheet.ciiva.com/7941/1697719-7941676.pdf?src-supplier=Element14; ComponentLink9Description: https://datasheet.ciiva.com/7941/1697719-7941676.pdf?src-supplier=Element14; ComponentLink10URL: https://datasheet.ciiva.com/7941/1697719-7941678.pdf?src-supplier=Element14; ComponentLink10Description: https://datasheet.ciiva.com/7941/1697719-7941678.pdf?src-supplier=Element14; ComponentLink11URL: https://datasheet.ciiva.com/16747/rc0805-16747226.pdf?src-supplier=Future+Electronics; ComponentLink11Description: https://datasheet.ciiva.com/16747/rc0805-16747226.pdf?src-supplier=Future+Electronics; Supplier Part Number 1: 2952521
R11 R14 R24 = RC0805FR-101KL: SMD Chip Resistor, 1 kOhm, ± 1%, 125 mW, 0805 [2012 Metric], Thick Film, General Purpose; Manufacturer: Yageo; Resistance: 1kR; Temperature Coefficient: 100ppm/°C; Power Rating: 125mW; Voltage Rating: 150V; Supplier 1: Digi-Key; Manufacturer Part Number: RC0805FR-101KL; RoHS: Yes; Category: Chip SMD Resistors; Stock 1: 42143; Pricing 1: 1=0.1, 10=0.025, 50=0.016, 100=0.0133, 500=0.00912, 1000=0.00787, 5000=0.00577 (USD); Case/Package: 0805; Contact Plating: Tin,Lead; Case Code (Imperial): 0805; Case Code (Metric): 2012; Min Operating Temperature: -55°C; Max Operating Temperature: 155°C; Tolerance: 1%; Resistor Type: Thick Film; Packaging: Tape and Reel; Termination: SMD/SMT; Series: RC; Resistance Tolerance: 1%; Voltage Rating (DC): 150V; Length: 2mm; Width: 1.25mm; Height: 0.5mm; Reach SVHC Compliant: No; RoHS Compliant: Yes; ComponentLink1URL: https://datasheet.ciiva.com/12561/rc0805-257173-12561685.pdf?src-supplier=Mouser; ComponentLink1Description: https://datasheet.ciiva.com/12561/rc0805-257173-12561685.pdf?src-supplier=Mouser; ComponentLink2URL: https://datasheet.ciiva.com/7983/444164-7983758.pdf?src-supplier=Element14; ComponentLink2Description: https://datasheet.ciiva.com/7983/444164-7983758.pdf?src-supplier=Element14
R15 R25 = RC0805FR-071ML: SMD Chip Resistor, 1 MOhm, ± 1%, 125 mW, 0805 [2012 Metric], Thick Film, General Purpose; Manufacturer: Yageo; Resistance: 1MR; Power Rating: 125mW; Temperature Coefficient: 250ppm/°C; Voltage Rating: 150V; Supplier 1: Future Electronics; Manufacturer Part Number: RC0805FR-071ML; RoHS: Yes; Category: Chip SMD Resistors; Stock 1: 2575000; Pricing 1: 5000=0.0025, 25000=0.0024, 125000=0.0022, 500000=0.0021, 1250000=0.002 (USD); Case/Package: Molded; Case Code (Metric): 2012; Case Code (Imperial): 0805; Size Code: 0805; Min Operating Temperature: -55°C; Max Operating Temperature: 155°C; Resistor Type: Thick Film; Tolerance: 1%; Packaging: Tape and Reel; Construction: Rectangular; Resistance Tolerance: 1%; Voltage Rating (AC): 150V; Length: 2mm; Depth: 1.25mm; Lead Free: Lead Free; RoHS Compliant: Yes; Reach SVHC Compliant: Unknown; Military Standard: Not; Supplier Part Number 1: 7283393
SCKT_FOR_U1 = 28_dip_socket: Socket DIP 28Cnts DualWipe 0.3InSpc. PhosphorBronze Nickel KinkedTail 4800Series | 3M 4828-3004-CP; Supplier 1: Digi-Key; Manufacturer: 3M; Manufacturer Part Number: 4828-3004-CP; RoHS: Yes; Category: Connectors; Stock 1: 15654; Pricing 1: 1=1.06, 10=0.896, 25=0.8588, 50=0.8406, 100=0.8041, 250=0.73104, 500=0.65794, 1000=0.58483, 2500=0.53 (USD); ComponentLink1URL: https://datasheet.ciiva.com/768/ts1099-768354.pdf?src-supplier=Digi-Key; ComponentLink1Description: https://datasheet.ciiva.com/768/ts1099-768354.pdf?src-supplier=Digi-Key; Supplier Part Number 1: 3M5480-ND
SW1 SW2 = 1825910-6: Alcoswitch, Switch, Pushbutton, Tactile, SPST, 50mA, Thru Hole, 6mm | TE Connectivity FSM4JH; Manufacturer: TE Connectivity Alcoswitch; Mechanical Life: 100000Cycles; Actuator Material: PBT; Number of Positions: 2NUMBER; Insulation Resistance: 100MR; Operating Force: 160gf; Max Voltage Rating (DC): 24V; Illumination Type: Non-Illuminated,Illuminated; Switch Travel: 0.25mm; Switch Function: Off-Mom; Actuator Type: Standard; Actuator Length: 0.055inch; Supplier 1: Arrow Electronics; Manufacturer Part Number: 1825910-6; RoHS: Yes; Category: Pushbutton Switches; Stock 1: 89385; Pricing 1: 1=0.1297, 10=0.1247, 25=0.1182, 100=0.1076, 250=0.1011, 500=0.0925, 1000=0.0774, 2500=0.0753, 5000=0.071 (USD); Mount: Through Hole; Color: 46Colour; Contact Material: Copper Alloy; Contact Plating: Silver; Material: 4261ConductorMaterial; Min Operating Temperature: -35°C; Max Operating Temperature: 85°C; Current Rating: 50mA; Throw Configuration: SPST; Max Current Rating: 50mA; Packaging: Loose Piece; Termination: PC Pins; Contact Current Rating: 50mA; Type: Switch; Series: FSMJ; Length: 5.99mm; Width: 6mm; ELV: Compliant; Lead Free: Lead Free; Reach SVHC Compliant: Unknown; RoHS Compliant: Yes
U1 U4 U5 U7 = AND_GATE: 1-ch, 2-input 2-V to 5.5-V high-speed (9 ns) AND gate with open-drain outputs 5-SOT-23 -55 to 125; Manufacturer: Texas Instruments; Min Supply Voltage: 2V; Max Supply Voltage: 5.5V; Quiescent Current: 1uA; Number of Inputs: 2; Propagation Delay: 7.5ns; Output Current: 25mA; Number of Circuits: 1; Low Level Output Current: 8mA; Number of Channels: 1NUMBER; Supplier 1: Mouser; Manufacturer Part Number: SN74AHC1G09DBVR; RoHS: Yes; Category: Logic Gates; Stock 1: 13606; Pricing 1: 1=0.33, 10=0.226, 50=0.226, 100=0.099, 1000=0.07, 10000=0.051 (USD); Mount: Surface Mount; Case/Package: SOT-23; Number of Pins: 5; Min Operating Temperature: -55°C; Max Operating Temperature: 125°C; Logic Function: AND GATE; Package Quantity: 3000; Packaging: Tape and Reel; Number of Gates: 1; Number of Elements: 1; Number of Bits: 1; Series: 74AHC; Technology: CMOS; Output Voltage: 5.5V; Number of Outputs: 1; Nominal Supply Current: 1uA; Length: 2.9mm; Width: 1.6mm; Height: 1.45mm; Thickness: 1.2mm; Radiation Hardening: No; Reach SVHC Compliant: No; Lead Free: Lead Free; RoHS Compliant: Yes; ComponentLink1URL: https://datasheet.ciiva.com/1864/sn74ahc1g09-1864411.pdf?src-supplier=Digi-Key; ComponentLink1Description: https://datasheet.ciiva.com/1864/sn74ahc1g09-1864411.pdf?src-supplier=Digi-Key; ComponentLink2URL: https://datasheet.ciiva.com/1864/sn74ahc1g09-1864410.pdf?src-supplier=Digi-Key; ComponentLink2Description: https://datasheet.ciiva.com/1864/sn74ahc1g09-1864410.pdf?src-supplier=Digi-Key; ComponentLink3URL: https://datasheet.ciiva.com/1864/sn74ahc1g09-1864412.pdf?src-supplier=Digi-Key; ComponentLink3Description: https://datasheet.ciiva.com/1864/sn74ahc1g09-1864412.pdf?src-supplier=Digi-Key; Supplier Part Number 1: 595-SN74AHC1G09DBVR